# EAGLE design DP_eDP_10inch (EAGLE 9.4.2)
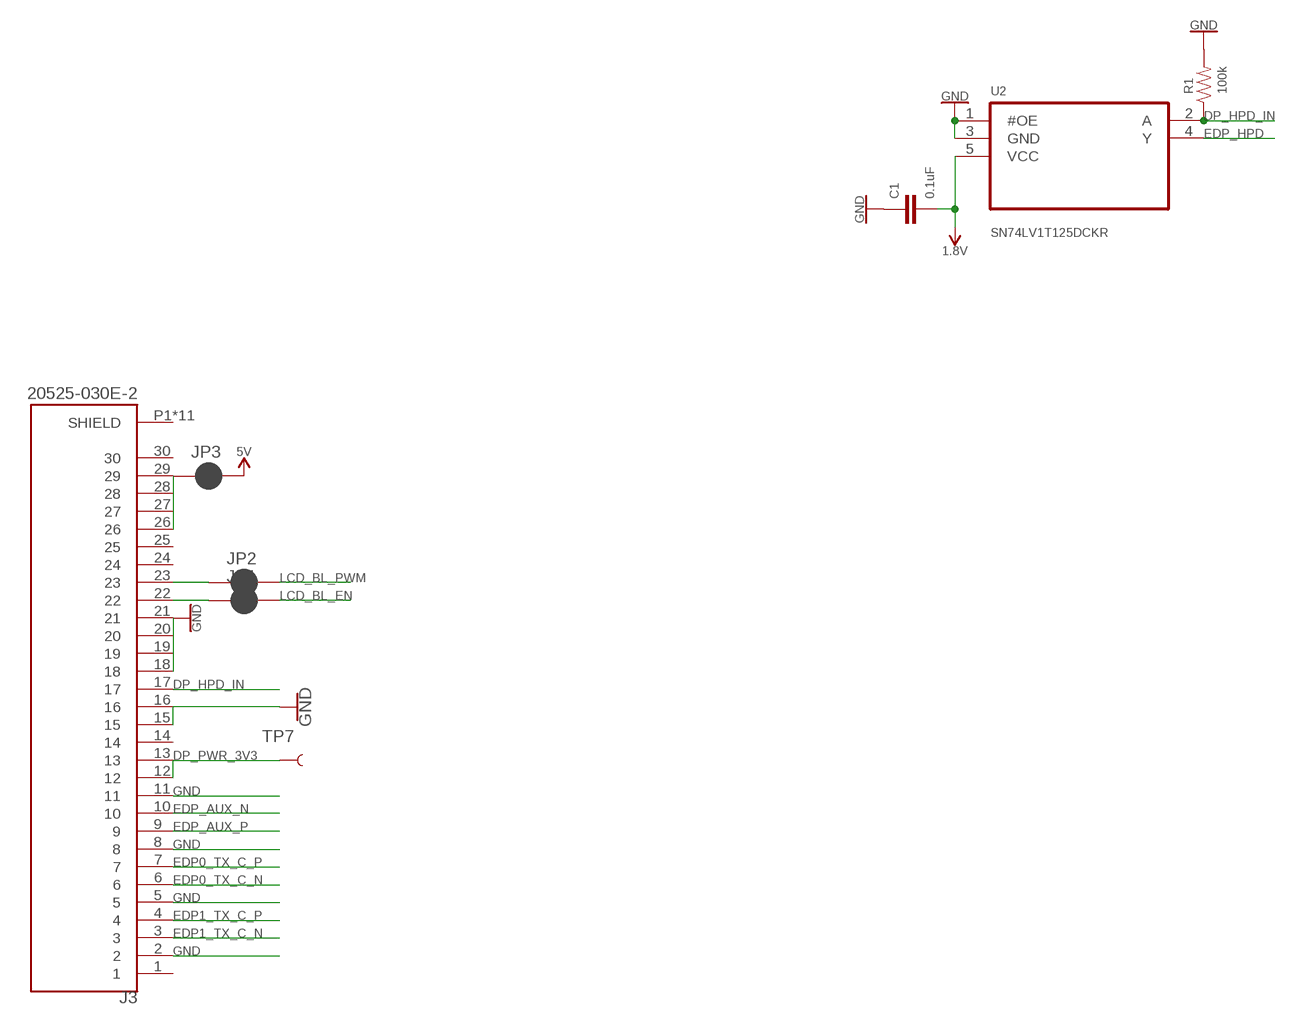
[diagram p0: schematic, sheet 1]

## Parts
C1  0.1uF  10NF-0603-50V-10%  [0603]
J3  20525-030E-2  [I-PEX_20525-030E-2]
JP1  JUMPER-SMT_2_NC_PASTE_NO-SILK  [SMT-JUMPER_2_NC_PASTE_NO-SILK]
JP2  JUMPER-SMT_2_NC_PASTE_NO-SILK  [SMT-JUMPER_2_NC_PASTE_NO-SILK]
JP3  JUMPER-SMT_2_NC_PASTE_NO-SILK  [SMT-JUMPER_2_NC_PASTE_NO-SILK]
R1  100k  RESISTOR0603-RES  [0603-RES]
TP7  TEST-POINT3  [PAD.03X.03]
U2  SN74LV1T125DCKR  [SOT65P210X110-5N]

## Nets
1.8V: C1.2 U2.5(VCC)
5V: JP3.2
DP_HPD_IN: J3.17 R1.1 U2.2(A)
DP_PWR_3V3: J3.12 J3.13 TP7.P$1
EDP0_TX_C_N: J3.6
EDP0_TX_C_P: J3.7
EDP1_TX_C_N: J3.3
EDP1_TX_C_P: J3.4
EDP_AUX_N: J3.10
EDP_AUX_P: J3.9
EDP_HPD: U2.4(Y)
GND: C1.1 J3.2 J3.5 J3.8 J3.11 J3.15 J3.16 J3.18 J3.19 J3.20 J3.21 R1.2 U2.1(#OE) U2.3(GND)
LCD_BL_EN: JP1.2
LCD_BL_PWM: JP2.2
N$1: J3.22 JP1.1
N$2: J3.23 JP2.1
N$3: J3.26 J3.27 J3.28 J3.29 JP3.1
Unconnected: J3.1 J3.14 J3.24 J3.25 J3.30 J3.P1(SHIELD) J3.P2(SHIELD) J3.P3(SHIELD) J3.P4(SHIELD) J3.P5(SHIELD) J3.P6(SHIELD) J3.P7(SHIELD) J3.P8(SHIELD) J3.P9(SHIELD) J3.P10(SHIELD) J3.P11(SHIELD)

## Library data of the parts
C1 = SparkFun-Capacitors:10NF: 0.01uF/10nF/10,000pF ceramic capacitors A capacitor is a passive two-terminal electrical component used to store electrical energy temporarily in an electric field. CAP-09321; PROD_ID: CAP-00867; VALUE: 10nF
J3 = 20525-030E-2:20525-030E-2: CABLINE-CA_30_RECE_WITHOUTBOSS; AVAILABILITY: Unavailable; MF: I-PEX; MP: 20525-030E-2; PACKAGE: None; PRICE: None
JP1-JP3 = SparkFun-Jumpers:JUMPER-SMT_2_NC_PASTE: Normally closed solder jumper This jumper has an aperture in the stencil to allow solder paste to bridge the split in the wire so it's normally closed (NC). Wick off the solder to open the connection. Reapply solder to reclose the connection.
R1 = SparkFun-Passives:RESISTOR: Resistor Basic schematic elements and footprints for 0603, 1206, and PTH resistors.
TP7 = SparkFun-Connectors:TEST-POINT: SparkFun Test Points Bare copper test points for troubleshooting or In-Circuit-Testing. These are used by our Production team for verifying production board runs using pogo-pins on test beds. SparkFun Products: SparkFun LSM9DS1 Breakout <https://www.sparkfun.com/products/13284> SparkFun PSOC <https://www.sparkfun.com/products/13714> SparkFun Load Cell Amplifier <https://www.sparkfun.com/products/13879>
U2 = SN74LV1T125DCKR:SN74LV1T125DCKR: None; AVAILABILITY: Unavailable; DESCRIPTION: Single Power Supply, Single BUFFER GATE w/ 3-State Output _active low enable_ 5-SC70 -40 to 125; MF: Texas Instruments; MP: SN74LV1T125DCKR; PACKAGE: SC-70-5 Texas Instruments; PRICE: None

## Board
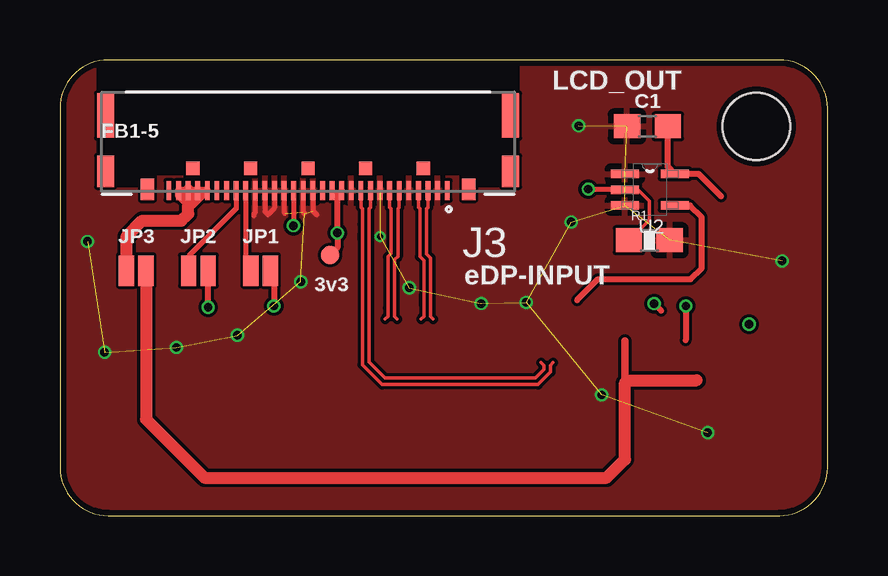
[diagram p1: board, top side]
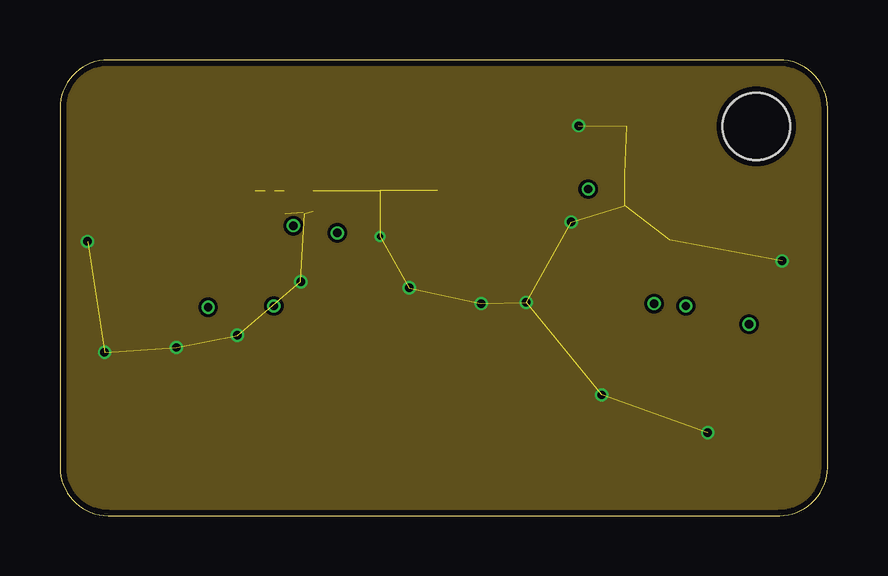
[diagram p2: board, inner layer Route2]
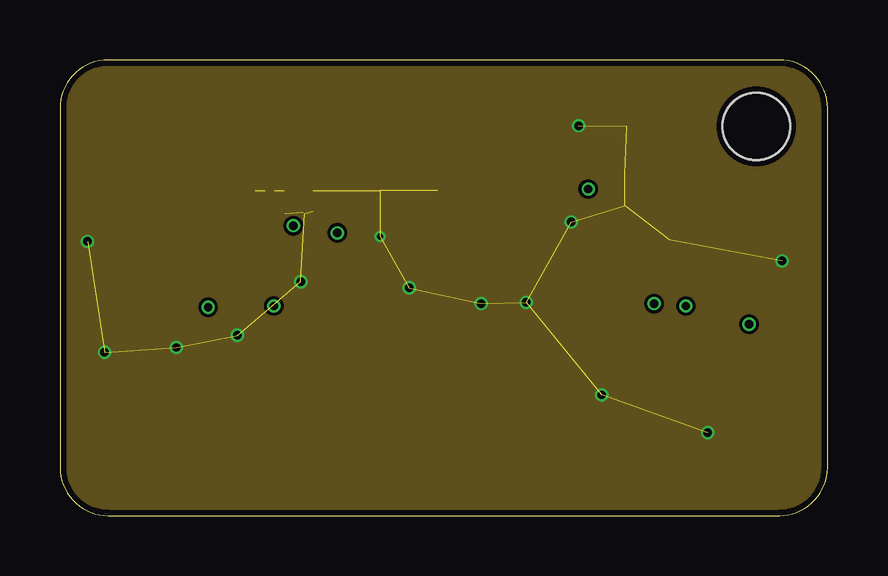
[diagram p3: board, inner layer Route15]
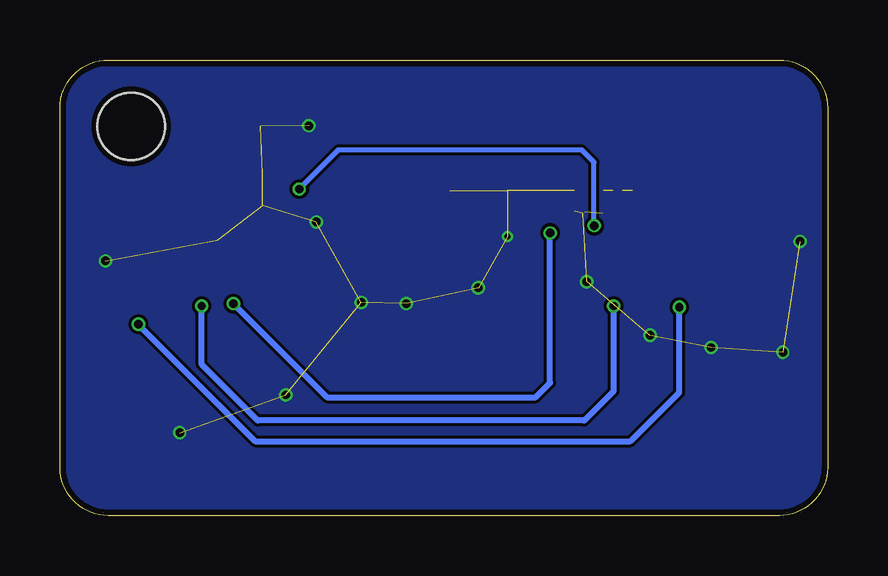
[diagram p4: board, bottom side, seen from below]

Size 32 x 19 mm. Coordinates in mm from the lower left corner, seen from the top.
Outline: 0,17 0,2 arc90 2,0 30,0 arc90 32,2 32,17 arc90 30,19 2,19 arc90 0,17
Copper layers (1*2*15*16): Top 0.035mm / dielectric 0.2mm / Route2 0.0175mm / dielectric 0.3mm / Route15 0.0175mm / dielectric 0.2mm / Bottom 0.035mm
Design rules "SeeedStudio_4layer_DRU_no_angle_20140221 *": minimum track width 4mil, minimum drill 0.2mm, track to track 5mil, track to pad 4mil, pad to pad 4mil, via to via 4mil, smd to smd 0mil, copper to edge 10mil, drill to drill 8mil, minimum pad ring 6mil, minimum via ring 4mil, stop-mask expansion 4mil, vias tented up to drill 25mil, thermal gap 10mil
Holes 2.8 mm at 29.03,16.22

### Footprints (pad centres in the part's own frame; a part is rotated, then mirrored left to right if it is on the bottom)
0603 = smd 1.1 x 1: 1 -0.85,0; 2 0.85,0
I-PEX_20525-030E-2 = smd 0.2 x 0.8: 1 -5.8,1.48; 2 -5.4,1.48; 3 -5,1.48; 4 -4.6,1.48; 5 -4.2,1.48; 6 -3.8,1.48; 7 -3.4,1.48; 8 -3,1.48; 9 -2.6,1.48; 10 -2.2,1.48; 11 -1.8,1.48; 12 -1.4,1.48; 13 -1,1.48; 14 -0.6,1.48; 15 -0.2,1.48; 16 0.2,1.48; 17 0.6,1.48; 18 1,1.48; 19 1.4,1.48; 20 1.8,1.48; 21 2.2,1.48; 22 2.6,1.48; 23 3,1.48; 24 3.4,1.48; 25 3.8,1.48; 26 4.2,1.48; 27 4.6,1.48; 28 5,1.48; 29 5.4,1.48; 30 5.8,1.48 | smd 0.55 x 0.9: P1 -6.7,1.43; P3 6.7,1.43 | smd 0.71 x 1.3: P2 -8.445,0.68; P4 8.445,0.68 | smd 0.71 x 1.85: P5 -8.445,-1.645; P6 8.445,-1.645 | smd 0.55 x 0.55: P7 -4.8,0.555; P8 0,0.555; P9 -2.4,0.555; P10 2.4,0.555; P11 4.8,0.555
SMT-JUMPER_2_NC_PASTE_NO-SILK = smd 0.635 x 1.27: 1 -0.406,0; 2 0.406,0
0603-RES = smd 1.1 x 1: 1 -0.85,0; 2 0.85,0
PAD.03X.03 = smd 0.762 x 0.762: P$1 0,0
SOT65P210X110-5N = smd 1.168 x 0.356: 1 -1.041,0.66; 2 -1.041,0; 3 -1.041,-0.66; 4 1.041,-0.66; 5 1.041,0.66

### Placement (x,y rotation side)
C1  24.49,16.23 0 top
J3  10.34,15.04 180 top
JP1  8.36,10.21 0 top
JP2  5.77,10.21 0 top
JP3  3.18,10.21 0 top
R1  24.57,11.48 0 top
TP7  11.26,10.87 0 top
U2  24.59,13.59 0 top

### Tracks (layer width: path | path; a pad name or v marks a point on that pad's centre or on a via)
1.8V
  Top 0.254: 27.56,13.32 26.63,14.25 U2.5 25.34,14.54 C1.2
5V
  Top 0.305: 26.55,5.64 26.56,5.65 | 23.55,5.54 23.55,7.28
  Top 0.508: JP3.2 3.59,4.01 6.03,1.57 22.79,1.57 23.55,2.34 23.55,5.54 23.65,5.64 26.55,5.64
DP_HPD_IN  (via drill 0.35)
  Top 0.152: R1.1 24.57,12.33 24.57,13.11 24.09,13.59 U2.2
  Top 0.203: J3.17 9.74,12.1 v9.73,12.09 | v22.03,13.61 23.53,13.61 U2.2
  Bottom 0.203: v9.73,12.09 9.73,14.73 10.24,15.24 20.4,15.24 v22.03,13.61
DP_PWR_3V3  (via drill 0.35)
  Top 0.254: 25.06,8.55 v24.77,8.84 | v11.56,11.79 11.56,13.38 J3.12 | v11.56,11.79 11.56,13.34 J3.13 | v11.56,11.79 11.56,11.18 TP7.P$1
  Bottom 0.254: v24.77,8.84 20.86,4.93 12.17,4.93 11.56,5.54 v11.56,11.79
EDP0_TX_C_N
  Top 0.152: 14.06,8.19 13.95,8.3 13.95,10.68 14.08,10.81 14.08,12.79 14.14,12.85 J3.6
EDP0_TX_C_P
  Top 0.152: 13.56,8.19 13.67,8.3 13.67,8.65 13.67,10.79 13.8,10.93 13.8,12.79 13.74,12.85 J3.7
EDP1_TX_C_N
  Top 0.152: J3.3 15.34,12.85 15.28,12.79 15.28,10.91 15.45,10.74 15.45,8.79 15.45,8.59 | 15.56,8.19 15.45,8.3 15.45,8.59 | 15.45,8.59
EDP1_TX_C_P
  Top 0.152: J3.4 14.94,12.85 15,12.79 15,10.79 15.17,10.63 15.17,9.2 15.17,9.19 15.17,8.99 | 15.06,8.19 15.17,8.3 15.17,8.79 15.17,8.99 | 15.17,8.99
EDP_AUX_N
  Top 0.152: 20.56,6.38 20.45,6.27 20.45,5.98 19.93,5.46 13.43,5.46 12.61,6.29 12.61,11.53 | J3.10 12.54,12.85 12.61,12.79 12.61,12.14 | 12.61,11.53 | 12.61,11.73 12.61,11.53 | 12.61,11.73 | 12.61,12.14 12.61,11.73 | 12.61,12.14
EDP_AUX_P
  Top 0.152: 20.06,6.38 20.17,6.27 20.17,6.1 19.81,5.74 13.54,5.74 12.88,6.4 12.88,11.73 | J3.9 12.94,12.85 12.88,12.79 12.88,12.34 | 12.88,11.73 | 12.88,12.14 12.88,11.73 | 12.88,12.14 | 12.88,12.34 12.88,12.14 | 12.88,12.34
EDP_HPD
  Top 0.254: U2.4 26.27,12.93 26.75,12.45 26.75,10.31 26.3,9.86 22.43,9.86 21.56,8.98
GND  (via drill 0.25, 0.35)  (26 unrouted)
  Top 0.152: J3.5 14.56,13.54
  Top 0.203: J3.21 8.14,12.64 8.07,12.57 8.07,12.5 | J3.20 8.54,12.67 8.67,12.55 8.94,12.82 J3.19 | J3.18 9.34,12.63 9.38,12.6 | J3.16 10.14,12.65 10.19,12.6 | J3.15 10.54,12.7 10.7,12.55
  other vias: 17.56,8.84 19.44,8.89 14.56,9.5 13.34,11.63 10.04,9.75 7.4,7.52 4.86,7.01 1.86,6.81 22.59,5.03 27.01,3.45 30.11,10.62 21.32,12.24 1.15,11.43 21.62,16.26
  pour Top: -1,20 33,20 33,-1 -1,-1
  pour Route2: -4,28 34,28 34,-2 -4,-2
  pour Bottom: -4,30 36,30 36,-4 -4,-4
  pour Route15: -5,29 35,29 35,-3 -5,-3
LCD_BL_EN  (via drill 0.35)
  Top 0.254: JP1.2 8.92,10.06 v8.92,8.74 | v26.09,8.74 26.09,7.32
  Bottom 0.254: v8.92,8.74 8.92,5.18 10.14,3.96 23.76,3.96 26.09,6.3 v26.09,8.74
LCD_BL_PWM  (via drill 0.35)
  Top 0.254: 28.73,7.96 v28.73,7.98 | v6.18,8.69 JP2.2
  Bottom 0.254: v28.73,7.98 23.86,3.1 8.21,3.1 6.18,5.13 v6.18,8.69
N$1
  Top 0.203: J3.22 7.74,10.42 JP1.1
N$2
  Top 0.203: J3.23 7.34,12.8 5.37,10.82 JP2.1
N$3
  Top 0.305: J3.27 J3.28 J3.29 4.94,13.35 5.34,12.95 | J3.27 J3.26 5.54,12.95 5.34,12.95 | 5.34,12.95 5.34,13.16 J3.27
  Top 0.508: JP3.1 2.78,11.63 3.44,12.29 5.06,12.29 5.34,12.58 5.34,12.95 J3.28

### Text on the board
tPlace: LCD_OUT | FB1-5 | eDP-INPUT | 3v3